# Altium schematic sheet Flash.SchDoc
size A4; SheetNumber: 5
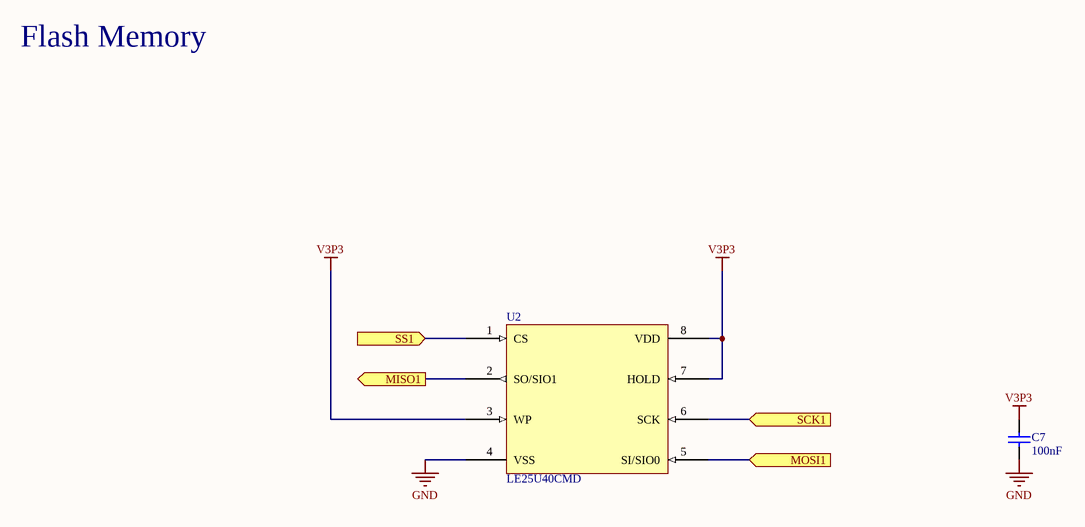
[diagram p0: Flash.SchDoc]

## Parts
C7  100nF  [own_0603]
U2  LE25U40CMD  [LE25U40CMDTWG]

## Ports
MISO1 (out), MOSI1 (in), SCK1 (in), SS1 (in)

## Nets
GND: C7.1 U2.4(VSS)
V3P3: C7.2 U2.3(WP) U2.7(HOLD) U2.8(VDD)
MISO1: U2.2(SO/SIO1) ; port MISO1
MOSI1: U2.5(SI/SIO0) ; port MOSI1
SCK1: U2.6(SCK) ; port SCK1
SS1: U2.1(CS) ; port SS1

## Notes on the sheet
- Flash Memory

## Library data of the parts
C7 = Cap: Capacitor; Value: 100pF; Published: 8-Jun-2000; LatestRevisionDate: 17-Jul-2002; LatestRevisionNote: Re-released for DXP Platform.; PackageReference: RAD-0.3; Publisher: Altium Limited; PackageDescription: Radial Cap, Thru-Hole; 2 Leads; 0.3 in Pin Spacing
U2 = LE25U40CMD: Flash memory; Fabricant: On Semiconductor; Fournisseur: Farnell; RefFournisseur: 2627898; RefFabricant: LE25U40CMDTWG